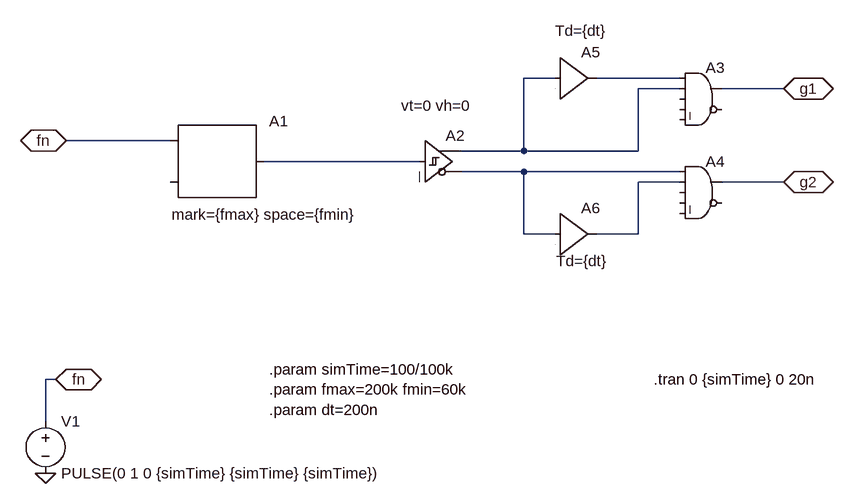
[diagram p0: schematic userLib_PFM_v0.1.asc]
userLib_PFM_v0.1.asc, the LTspice schematic file:
Version 4
SHEET 1 1648 680
WIRE 784 -208 736 -208
WIRE 976 -208 848 -208
WIRE 976 -192 912 -192
WIRE 1136 -192 1040 -192
WIRE 192 -112 32 -112
WIRE 736 -96 736 -208
WIRE 736 -96 640 -96
WIRE 912 -96 912 -192
WIRE 912 -96 736 -96
WIRE 576 -80 336 -80
WIRE 736 -64 640 -64
WIRE 976 -64 736 -64
WIRE 976 -48 912 -48
WIRE 1136 -48 1040 -48
WIRE 736 32 736 -64
WIRE 784 32 736 32
WIRE 912 32 912 -48
WIRE 912 32 848 32
WIRE 16 256 0 256
WIRE 0 320 0 256
FLAG 32 -112 fn
IOPIN 32 -112 BiDir
FLAG 1136 -192 g1
IOPIN 1136 -192 BiDir
FLAG 1136 -48 g2
IOPIN 1136 -48 BiDir
FLAG 16 256 fn
IOPIN 16 256 BiDir
FLAG 0 400 0
SYMBOL SpecialFunctions\\modulate 192 -112 R0
WINDOW 3 2 114 Left 2
SYMATTR Value mark={fmax} space={fmin}
SYMATTR InstName A1
SYMBOL Digital\\schmitt 576 -144 R0
WINDOW 3 -29 -22 Left 2
SYMATTR Value vt=0 vh=0
SYMATTR InstName A2
SYMBOL Digital\\and 1008 -240 R0
SYMATTR InstName A3
SYMBOL Digital\\and 1008 -96 R0
SYMATTR InstName A4
SYMBOL voltage 0 304 R0
WINDOW 123 0 0 Left 0
WINDOW 39 0 0 Left 0
SYMATTR InstName V1
SYMATTR Value PULSE(0 1 0 {simTime} {simTime} {simTime})
SYMBOL Digital\\buf1 784 -272 R0
WINDOW 3 0 -9 Left 2
SYMATTR Value Td={dt}
SYMATTR InstName A5
SYMBOL Digital\\buf1 784 -32 R0
WINDOW 3 2 105 Left 2
SYMATTR Value Td={dt}
SYMATTR InstName A6
TEXT 936 256 Left 2 !.tran 0 {simTime} 0 20n
TEXT 344 240 Left 2 !.param simTime=100/100k\n.param fmax=200k fmin=60k\n.param dt=200n

The netlist it stands for:
* userLib_PFM_v0.1.asc
A1 fn 0 0 0 0 0 N003 0 MODULATOR mark={fmax} space={fmin}
A2 N003 0 0 0 0 N004 N001 0 SCHMITT vt=0 vh=0
A3 N002 N001 0 0 0 0 g1 0 AND
A4 N004 N005 0 0 0 0 g2 0 AND
V1 fn 0 PULSE(0 1 0 {simTime} {simTime} {simTime})
A5 N001 0 0 0 0 0 N002 0 BUF Td={dt}
A6 N004 0 0 0 0 0 N005 0 BUF Td={dt}
.tran 0 {simTime} 0 20n
.param simTime=100/100k
.param fmax=200k fmin=60k
.param dt=200n
.backanno
.end